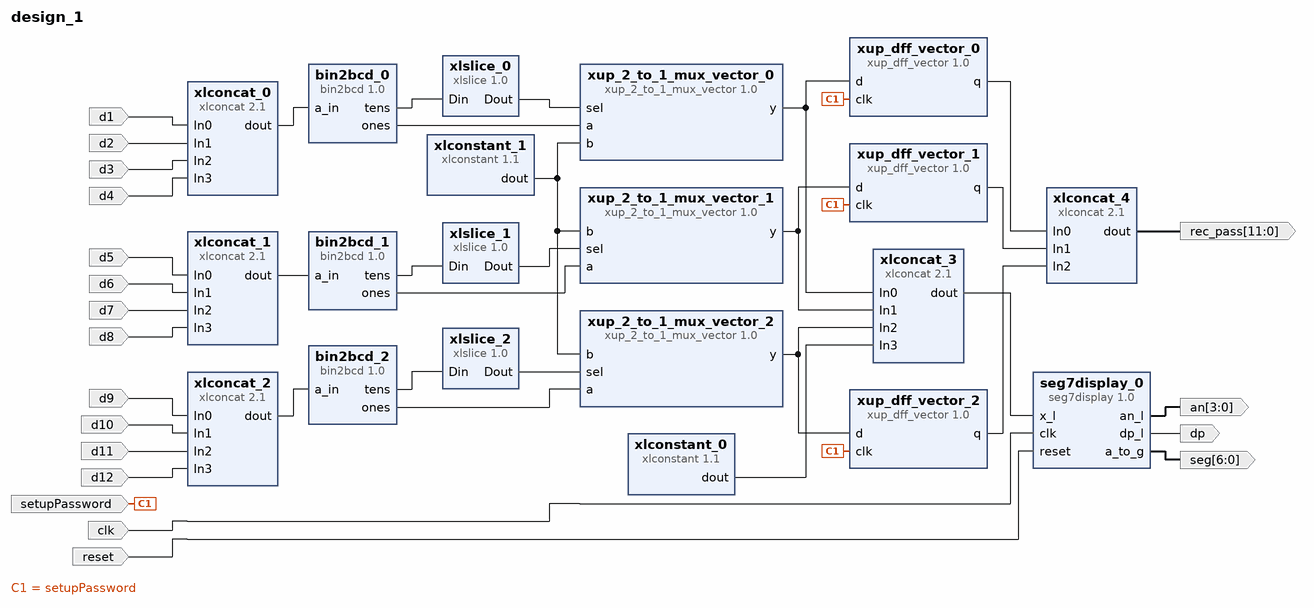
[diagram p0: block diagram of the top level]
# Vivado block design design_1, xc7a35tcpg236-1, Vivado 2018.2
create_bd_design design_1

create_bd_port -dir I d1
create_bd_port -dir I d2
create_bd_port -dir I d3
create_bd_port -dir I d4
create_bd_port -dir I d5
create_bd_port -dir I d6
create_bd_port -dir I d7
create_bd_port -dir I d8
create_bd_port -dir I d9
create_bd_port -dir I d10
create_bd_port -dir I d11
create_bd_port -dir I d12
create_bd_port -dir I -type clk clk
create_bd_port -dir I reset
create_bd_port -dir O -from 6 -to 0 seg
create_bd_port -dir O -from 3 -to 0 an
create_bd_port -dir O dp
create_bd_port -dir I setupPassword
create_bd_port -dir O -from 11 -to 0 rec_pass

create_bd_cell -type ip -vlnv xilinx.com:XUP:bin2bcd:1.0 bin2bcd_0
set_property -dict {CONFIG.SIZE 4} [get_bd_cells bin2bcd_0]
create_bd_cell -type ip -vlnv xilinx.com:XUP:bin2bcd:1.0 bin2bcd_1
set_property -dict {CONFIG.SIZE 4} [get_bd_cells bin2bcd_1]
create_bd_cell -type ip -vlnv xilinx.com:XUP:bin2bcd:1.0 bin2bcd_2
set_property -dict {CONFIG.SIZE 4} [get_bd_cells bin2bcd_2]
create_bd_cell -type ip -vlnv xilinx.com:ip:xlconcat:2.1 xlconcat_0
set_property -dict {CONFIG.NUM_PORTS 4} [get_bd_cells xlconcat_0]
create_bd_cell -type ip -vlnv xilinx.com:ip:xlconcat:2.1 xlconcat_1
set_property -dict {CONFIG.NUM_PORTS 4} [get_bd_cells xlconcat_1]
create_bd_cell -type ip -vlnv xilinx.com:ip:xlconcat:2.1 xlconcat_2
set_property -dict {CONFIG.NUM_PORTS 4} [get_bd_cells xlconcat_2]
create_bd_cell -type ip -vlnv xilinx.com:ip:xlconcat:2.1 xlconcat_3
set_property -dict [list \
  CONFIG.NUM_PORTS 4 \
  CONFIG.IN0_WIDTH 4 \
  CONFIG.IN1_WIDTH 4 \
  CONFIG.IN2_WIDTH 4 \
  CONFIG.IN3_WIDTH 4 \
] [get_bd_cells xlconcat_3]
create_bd_cell -type ip -vlnv xilinx.com:ip:xlconstant:1.1 xlconstant_0
set_property -dict {CONFIG.CONST_WIDTH 4 CONFIG.CONST_VAL 0} [get_bd_cells xlconstant_0]
create_bd_cell -type ip -vlnv xilinx.com:XUP:seg7display:1.0 seg7display_0
create_bd_cell -type ip -vlnv xilinx.com:ip:xlconstant:1.1 xlconstant_1
set_property -dict {CONFIG.CONST_WIDTH 4 CONFIG.CONST_VAL 9} [get_bd_cells xlconstant_1]
create_bd_cell -type ip -vlnv xilinx.com:ip:xlslice:1.0 xlslice_0
set_property -dict {CONFIG.DIN_TO 0 CONFIG.DIN_FROM 0 CONFIG.DIN_WIDTH 4 CONFIG.DOUT_WIDTH 1} [get_bd_cells xlslice_0]
create_bd_cell -type ip -vlnv xilinx.com:XUP:xup_2_to_1_mux_vector:1.0 xup_2_to_1_mux_vector_0
create_bd_cell -type ip -vlnv xilinx.com:ip:xlslice:1.0 xlslice_1
set_property -dict {CONFIG.DIN_TO 0 CONFIG.DIN_FROM 0 CONFIG.DIN_WIDTH 4 CONFIG.DOUT_WIDTH 1} [get_bd_cells xlslice_1]
create_bd_cell -type ip -vlnv xilinx.com:ip:xlslice:1.0 xlslice_2
set_property -dict {CONFIG.DIN_TO 0 CONFIG.DIN_FROM 0 CONFIG.DIN_WIDTH 4 CONFIG.DOUT_WIDTH 1} [get_bd_cells xlslice_2]
create_bd_cell -type ip -vlnv xilinx.com:XUP:xup_2_to_1_mux_vector:1.0 xup_2_to_1_mux_vector_2
create_bd_cell -type ip -vlnv xilinx.com:XUP:xup_dff_vector:1.0 xup_dff_vector_0
create_bd_cell -type ip -vlnv xilinx.com:XUP:xup_dff_vector:1.0 xup_dff_vector_1
create_bd_cell -type ip -vlnv xilinx.com:XUP:xup_dff_vector:1.0 xup_dff_vector_2
create_bd_cell -type ip -vlnv xilinx.com:XUP:xup_2_to_1_mux_vector:1.0 xup_2_to_1_mux_vector_1
create_bd_cell -type ip -vlnv xilinx.com:ip:xlconcat:2.1 xlconcat_4
set_property -dict {CONFIG.NUM_PORTS 3 CONFIG.IN0_WIDTH 4 CONFIG.IN1_WIDTH 4 CONFIG.IN2_WIDTH 4} [get_bd_cells xlconcat_4]

# ---- connections ----

connect_bd_net -net d1_1 [get_bd_ports d1] [get_bd_pins xlconcat_0/In0]
connect_bd_net -net d2_1 [get_bd_ports d2] [get_bd_pins xlconcat_0/In1]
connect_bd_net -net d3_1 [get_bd_ports d3] [get_bd_pins xlconcat_0/In2]
connect_bd_net -net d4_1 [get_bd_ports d4] [get_bd_pins xlconcat_0/In3]
connect_bd_net -net d5_1 [get_bd_ports d5] [get_bd_pins xlconcat_1/In0]
connect_bd_net -net d6_1 [get_bd_ports d6] [get_bd_pins xlconcat_1/In1]
connect_bd_net -net d7_1 [get_bd_ports d7] [get_bd_pins xlconcat_1/In2]
connect_bd_net -net d8_1 [get_bd_ports d8] [get_bd_pins xlconcat_1/In3]
connect_bd_net -net d9_1 [get_bd_ports d9] [get_bd_pins xlconcat_2/In0]
connect_bd_net -net d10_1 [get_bd_ports d10] [get_bd_pins xlconcat_2/In1]
connect_bd_net -net d11_1 [get_bd_ports d11] [get_bd_pins xlconcat_2/In2]
connect_bd_net -net d12_1 [get_bd_ports d12] [get_bd_pins xlconcat_2/In3]
connect_bd_net [get_bd_pins xlconcat_0/dout] [get_bd_pins bin2bcd_0/a_in]
connect_bd_net [get_bd_pins xlconcat_1/dout] [get_bd_pins bin2bcd_1/a_in]
connect_bd_net [get_bd_pins xlconcat_2/dout] [get_bd_pins bin2bcd_2/a_in]
connect_bd_net [get_bd_pins xlconstant_0/dout] [get_bd_pins xlconcat_3/In3]
connect_bd_net [get_bd_ports clk] [get_bd_pins seg7display_0/clk]
connect_bd_net [get_bd_ports reset] [get_bd_pins seg7display_0/reset]
connect_bd_net [get_bd_pins seg7display_0/a_to_g] [get_bd_ports seg]
connect_bd_net [get_bd_pins seg7display_0/an_l] [get_bd_ports an]
connect_bd_net [get_bd_pins seg7display_0/dp_l] [get_bd_ports dp]
connect_bd_net [get_bd_pins bin2bcd_0/tens] [get_bd_pins xlslice_0/Din]
connect_bd_net [get_bd_pins xlslice_0/Dout] [get_bd_pins xup_2_to_1_mux_vector_0/sel]
connect_bd_net [get_bd_pins xup_2_to_1_mux_vector_0/y] [get_bd_pins xlconcat_3/In0] [get_bd_pins xup_dff_vector_0/d]
connect_bd_net [get_bd_pins bin2bcd_1/tens] [get_bd_pins xlslice_1/Din]
connect_bd_net [get_bd_pins bin2bcd_2/tens] [get_bd_pins xlslice_2/Din]
connect_bd_net [get_bd_pins xlslice_2/Dout] [get_bd_pins xup_2_to_1_mux_vector_2/sel]
connect_bd_net [get_bd_pins xup_2_to_1_mux_vector_2/y] [get_bd_pins xlconcat_3/In2] [get_bd_pins xup_dff_vector_2/d]
connect_bd_net [get_bd_pins xup_2_to_1_mux_vector_1/y] [get_bd_pins xlconcat_3/In1] [get_bd_pins xup_dff_vector_1/d]
connect_bd_net [get_bd_pins bin2bcd_0/ones] [get_bd_pins xup_2_to_1_mux_vector_0/a]
connect_bd_net [get_bd_pins xlconstant_1/dout] \
  [get_bd_pins xup_2_to_1_mux_vector_0/b] [get_bd_pins xup_2_to_1_mux_vector_2/b] [get_bd_pins xup_2_to_1_mux_vector_1/b]
connect_bd_net [get_bd_pins bin2bcd_2/ones] [get_bd_pins xup_2_to_1_mux_vector_2/a]
connect_bd_net [get_bd_ports setupPassword] [get_bd_pins xup_dff_vector_0/clk] [get_bd_pins xup_dff_vector_1/clk] [get_bd_pins xup_dff_vector_2/clk]
connect_bd_net [get_bd_pins xlconcat_3/dout] [get_bd_pins seg7display_0/x_l]
connect_bd_net [get_bd_pins xlslice_1/Dout] [get_bd_pins xup_2_to_1_mux_vector_1/sel]
connect_bd_net [get_bd_pins bin2bcd_1/ones] [get_bd_pins xup_2_to_1_mux_vector_1/a]
connect_bd_net [get_bd_pins xup_dff_vector_0/q] [get_bd_pins xlconcat_4/In0]
connect_bd_net [get_bd_pins xup_dff_vector_1/q] [get_bd_pins xlconcat_4/In1]
connect_bd_net [get_bd_pins xup_dff_vector_2/q] [get_bd_pins xlconcat_4/In2]
connect_bd_net [get_bd_pins xlconcat_4/dout] [get_bd_ports rec_pass]

validate_bd_design
save_bd_design
